# Altium project finger_fpc.PrjPcb
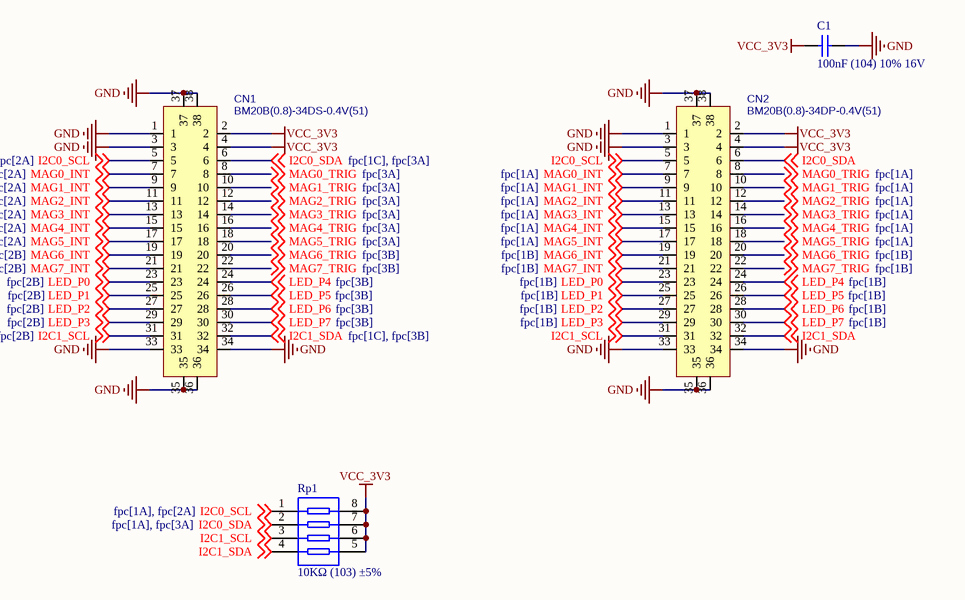
[diagram p0: fpc.SchDoc]
1 sheet, 4 parts. Net scope: global (net labels, ports and power ports of the same name join across sheets).
Board file: fpc.PcbDoc

## Sheet fpc.SchDoc
size A4; SheetNumber: 1; SheetTotal: 1

### Parts
C1  100nF (104) 10% 16V  [LC-0402_C_NOSILK]
CN1  BM20B(0.8)-34DS-0.4V(51)  [CONN-SMD_34P-P0.40_BM20B-0.8-34DS-0.4V-51]
CN2  BM20B(0.8)-34DP-0.4V(51)  [CONN-SMD_34P-P0.40_BM20B-0.8-34DP-0.4V-51]
Rp1  10KΩ (103) ±5%  [0402_Rx4]

### Nets
GND: C1.2 CN1.1 CN1.3 CN1.33 CN1.34 CN1.35 CN1.36 CN1.37 CN1.38 CN2.1 CN2.3 CN2.33 CN2.34 CN2.35 CN2.36 CN2.37 CN2.38
VCC_3V3: C1.1 CN1.2 CN1.4 CN2.2 CN2.4 Rp1.5 Rp1.6 Rp1.7 Rp1.8
I2C0_SCL: CN1.5 CN2.5 Rp1.1 ; off-sheet I2C0_SCL
I2C0_SDA: CN1.6 CN2.6 Rp1.2 ; off-sheet I2C0_SDA
I2C1_SCL: CN1.31 CN2.31 Rp1.3 ; off-sheet I2C1_SCL
I2C1_SDA: CN1.32 CN2.32 Rp1.4 ; off-sheet I2C1_SDA
LED_P0: CN1.23 CN2.23 ; off-sheet LED_P0
LED_P1: CN1.25 CN2.25 ; off-sheet LED_P1
LED_P2: CN1.27 CN2.27 ; off-sheet LED_P2
LED_P3: CN1.29 CN2.29 ; off-sheet LED_P3
LED_P4: CN1.24 CN2.24 ; off-sheet LED_P4
LED_P5: CN1.26 CN2.26 ; off-sheet LED_P5
LED_P6: CN1.28 CN2.28 ; off-sheet LED_P6
LED_P7: CN1.30 CN2.30 ; off-sheet LED_P7
MAG0_INT: CN1.7 CN2.7 ; off-sheet MAG0_INT
MAG0_TRIG: CN1.8 CN2.8 ; off-sheet MAG0_TRIG
MAG1_INT: CN1.9 CN2.9 ; off-sheet MAG1_INT
MAG1_TRIG: CN1.10 CN2.10 ; off-sheet MAG1_TRIG
MAG2_INT: CN1.11 CN2.11 ; off-sheet MAG2_INT
MAG2_TRIG: CN1.12 CN2.12 ; off-sheet MAG2_TRIG
MAG3_INT: CN1.13 CN2.13 ; off-sheet MAG3_INT
MAG3_TRIG: CN1.14 CN2.14 ; off-sheet MAG3_TRIG
MAG4_INT: CN1.15 CN2.15 ; off-sheet MAG4_INT
MAG4_TRIG: CN1.16 CN2.16 ; off-sheet MAG4_TRIG
MAG5_INT: CN1.17 CN2.17 ; off-sheet MAG5_INT
MAG5_TRIG: CN1.18 CN2.18 ; off-sheet MAG5_TRIG
MAG6_INT: CN1.19 CN2.19 ; off-sheet MAG6_INT
MAG6_TRIG: CN1.20 CN2.20 ; off-sheet MAG6_TRIG
MAG7_INT: CN1.21 CN2.21 ; off-sheet MAG7_INT
MAG7_TRIG: CN1.22 CN2.22 ; off-sheet MAG7_TRIG

### Library data of the parts
C1 = 0402 100nF (104) 10% 16V: 贴片电容; ComponentLink1Description: 供应商链接; ComponentLink1URL: http://www.szlcsc.com/product/details_1877.html; Package: 0402; Supplier: LC; SuppliersPartNumber: C1525
CN1 = BM20B(0.8)-34DS-0.4V(51): 0.4mm BTB连接器-34P 母; BOM_Manufacturer: HRS(广濑); Contributor: LCSC; BOM_Supplier: LCSC; BOM_Supplier Part: C424541; BOM_Manufacturer Part: BM20B(0.8)-34DS-0.4V(51); BOM_JLCPCB Part Class: Extended Part; spicePre: C; spiceSymbolName: BM20B(0.8)-34DS-0.4V(51)
CN2 = BM20B(0.8)-34DP-0.4V(51): 0.4mm BTB连接器-34P 公; BOM_Manufacturer: HRS(广濑); Contributor: LCSC; BOM_Supplier: LCSC; BOM_Supplier Part: C424540; BOM_Manufacturer Part: BM20B(0.8)-34DP-0.4V(51); BOM_JLCPCB Part Class: Extended Part; spicePre: C; spiceSymbolName: BM20B(0.8)-34DP-0.4V(51)
Rp1 = 0402*4 10KΩ (103) 5%: 贴片排阻; ComponentLink1Description: 供应商链接; ComponentLink1URL: http://www.szlcsc.com/product/details_26468.html; Package: 0402*4; Supplier: LC; SuppliersPartNumber: C25725